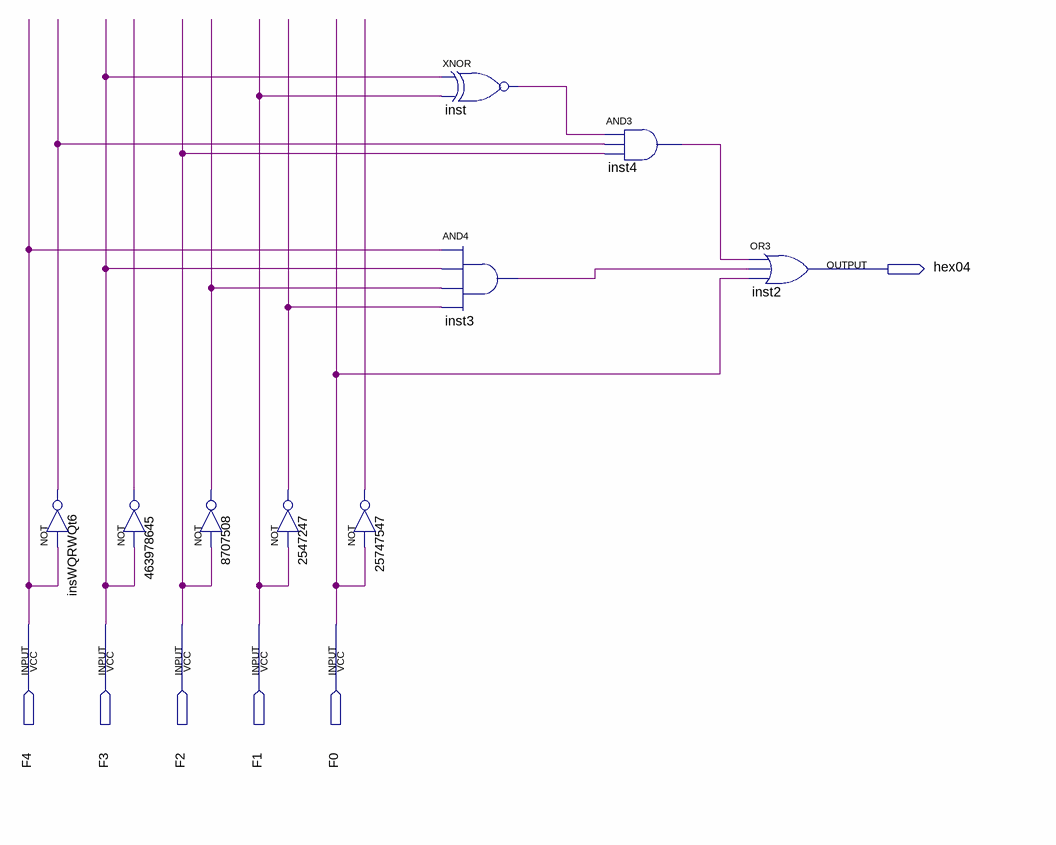
[diagram p0: schematic sheet]
// Quartus schematic U04.bdf as structural Verilog: 9 symbols, 6 pins
module U04 (
  input  F4,
  input  F3,
  input  F2,
  input  F1,
  input  F0,
  output hex04
);

  wire inst3_out, inst4_out, inst_out, insWQRWQt6_out, n2547247_out, n8707508_out, n25747547_out,
       n463978645_out;

  not insWQRWQt6 (insWQRWQt6_out, F4);
  not u_463978645 (n463978645_out, F3);
  not u_8707508 (n8707508_out, F2);
  not u_2547247 (n2547247_out, F1);
  not u_25747547 (n25747547_out, F0);
  xnor inst (inst_out, F3, F1);
  and inst3 (inst3_out, F4, F3, n8707508_out, n2547247_out);
  and inst4 (inst4_out, inst_out, insWQRWQt6_out, F2);
  or inst2 (hex04, inst4_out, inst3_out, F0);
endmodule
